# Altium project BLDC-Board-v1.0.PrjPcb (part 3 of 3)

## Sheet Power_Sheet.SchDoc
size 420 x 297 mm; SheetNumber: 2; SheetTotal: 8
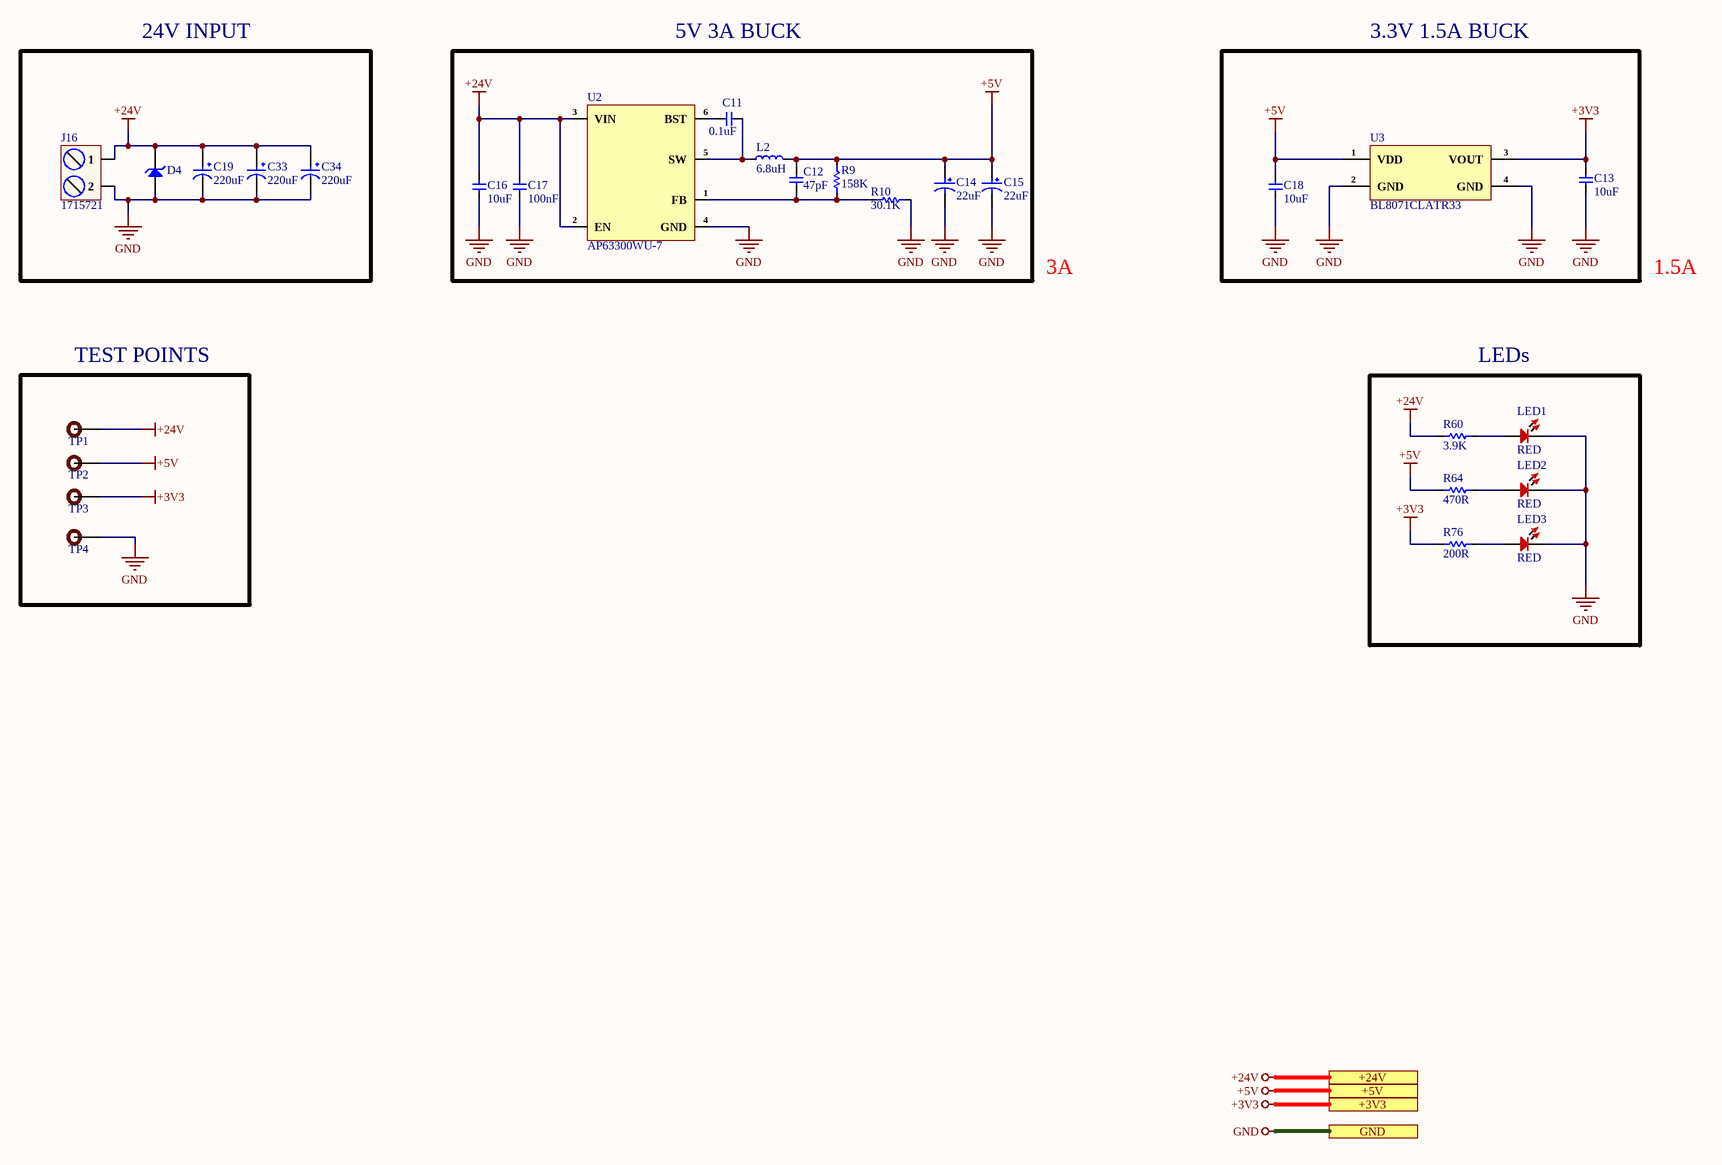
[diagram p6: Power_Sheet.SchDoc]

### Parts
C11  0.1uF  [Cap-0402]
C12  47pF  [Cap-0402]
C13  10uF  [Cap-0603]
C14  22uF  [VKMD1652D220MV]
C15  22uF  [VKMD1652D220MV]
C16  10uF  [Cap-0603]
C17  100nF  [cap-0402]
C18  10uF  [Cap-0603]
C19  220uF  [UCD-220uF-10mmDia]
C33  220uF  [UCD-220uF-10mmDia]
C34  220uF  [UCD-220uF-10mmDia]
D4  SMBJ28A-13-F  [SMB_]  (value not drawn)
J16  1715721  [1715721]
L2  6.8uH  [LVC505040-6R8M-N_]
LED1  RED  [LED-0603]
LED2  RED  [LED-0603]
LED3  RED  [LED-0603]
R9  158K  [Res-0402]
R10  30.1K  [Res-0402]
R60  3.9K  [Res-0402]
R64  470R  [Res-0402]
R76  200R  [Res-0402]
TP1  TEST POINT  [Test-point]  (value not drawn)  (no BOM)
TP2  TEST POINT  [Test-point]  (value not drawn)  (no BOM)
TP3  TEST POINT  [Test-point]  (value not drawn)  (no BOM)
TP4  TEST POINT  [Test-point]  (value not drawn)  (no BOM)
U2  AP63300WU-7  [SOT-23-6]
U3  BL8071CLATR33  [SOT- 223]

### Blocks framed on the sheet
24V INPUT: C19 C33 C34 D4 J16
5V 3A BUCK: C11 C12 C14-C17 L2 R9 R10 U2
3.3V 1.5A BUCK: C13 C18 U3
TEST POINTS: TP1-TP4

### Ports
+3V3 (see Top_Sheet[4C], CAN_Sheet[5D], Connector_Sheet1[5D], Connector_Sheet2[3D], Controller_Sheet[2D], Motor_Driver_Sheet[5D], RS485_RS232_Sheet[5D]), +5V (see Top_Sheet[4C], CAN_Sheet[5D], Connector_Sheet1[5D], Connector_Sheet2[3D]), +24V (see Top_Sheet[4C], Motor_Driver_Sheet[5D]), GND (see Top_Sheet[4C], CAN_Sheet[5D], Connector_Sheet1[5D], Connector_Sheet2[3D], Controller_Sheet[2D], Motor_Driver_Sheet[5D], RS485_RS232_Sheet[5D])

### Nets
+3V3: C13.2 R76.1 TP3.1 U3.3(VOUT) ; port +3V3
+5V: C12.2 C14.1 C15.1 C18.2 L2.2 R9.2 R64.1 TP2.1 U3.1(VDD) ; port +5V
+24V: C16.2 C17.2 C19.1 C33.1 C34.1 D4.2(K) J16.1 R60.1 TP1.1 U2.2(EN) U2.3(VIN) ; port +24V
GND: C13.1 C14.2 C15.2 C16.1 C17.1 C18.1 C19.2 C33.2 C34.2 D4.1(A) J16.2 LED1.2 LED2.2 LED3.2 R10.2 TP4.1 U2.4(GND) U3.2(GND) U3.4(GND) ; port GND
NetC11_1: C11.1 L2.1 U2.5(SW)
NetC11_2: C11.2 U2.6(BST)
NetC12_1: C12.1 R9.1 R10.1 U2.1(FB)
NetLED1_1: LED1.1 R60.2
NetLED2_1: LED2.1 R64.2
NetLED3_1: LED3.1 R76.2

### Notes on the sheet
- 3A
- 1.5A
- LEDs
- File:
- Title:
- Date:
- Page
- Num:
- Total:
- Drawn By: Huzaifa Ali

### Library data of the parts
C11 = C1005X5R1H104K050BB: CAP CER 0.1UF 50V X5R 0402; Manufacturer: TDK; Dielectric Material: Ceramic; Capacitance: 100nF; Tolerance: 10%; Item Type: Capacitor; Supplier 1: Digi-Key; Manufacturer Part Number: C1005X5R1H104K050BB; Stock 1: 1455182; Pricing 1: 1=0.12, 10=0.09, 50=0.049, 100=0.04, 500=0.02858, 1000=0.02245, 2500=0.02041, 5000=0.01878 (USD); Mount: Surface Mount; Case/Package: 0402; Case Code (Metric): 1005; Case Code (Imperial): 0402; Weight: 2.3E-05oz; Min Operating Temperature: -55°C; Max Operating Temperature: 85°C; Dielectric: X5R; Voltage Rating: 50V; Packaging: Tape and Reel; Voltage Rating (DC): 50V; Termination: SMD/SMT; Construction: Flat; Package Quantity: 1; Resistor Type: Ceramic; Voltage: 50V; Series: C; Length: 1mm; Width: 0.02inch; Height: 0.5mm; Depth: 0.5mm; Thickness: 0.022inch; Radiation Hardening: No; Lead Free: Lead Free; REACH SVHC: No SVHC; RoHS Compliant: Yes; ComponentLink1URL: https://product.tdk.com/info/en/catalog/spec/mlccspec_commercial_general_midvoltage_en.pdf?src-supplier=Digi-Key; ComponentLink1Description: https://product.tdk.com/info/en/catalog/spec/mlccspec_commercial_general_midvoltage_en.pdf?src-supplier=Digi-Key; ComponentLink2URL: http://www.tdk.co.jp/tefe02/e413_c.pdf?src-supplier=Future+Electronics; ComponentLink2Description: http://www.tdk.co.jp/tefe02/e413_c.pdf?src-supplier=Future+Electronics; ComponentLink3URL: https://www.verical.com/server-webapp/html/getDatasheet?partID=743571&src-supplier=Verical; ComponentLink3Description: https://www.verical.com/server-webapp/html/getDatasheet?partID=743571&src-supplier=Verical; ComponentLink4URL: http://www.tdk.co.jp/tefe02/e412_c.pdf?src-supplier=Avnet+Europe; ComponentLink4Description: http://www.tdk.co.jp/tefe02/e412_c.pdf?src-supplier=Avnet+Europe; Supplier Part Number 1: 445-5942-1-ND; LCSC Part Number: C2181865
C12 = GCM1555C1H470FA16D: CAP CER 47PF 50V C0G/NP0 0402; Manufacturer: Murata; Tolerance: 1%; Supplier 1: Digi-Key; Manufacturer Part Number: GCM1555C1H470FA16D; RoHS: No; Category: Ceramic Capacitors; Stock 1: 27098; Pricing 1: 1=0.11000, 10=0.07900, 50=0.04500, 100=0.03730, 500=0.02618, 1000=0.02168, 2500=0.02018, 5000=0.01846 (USD); Mount: Surface Mount; Case/Package: 0402; Case Code (Imperial): 0402; Case Code (Metric): 1005; Min Operating Temperature: -55°C; Max Operating Temperature: 125°C; Packaging: Tape and Reel; Capacitance: 47pF; Voltage Rating: 50V; Ratings: AEC-Q200; ComponentLink1URL: http://search.murata.co.jp/Ceramy/image/img/A01X/G101/ENG/GCM1555C1H470FA16-01.pdf?src-supplier=Digi-Key; ComponentLink1Description: http://search.murata.co.jp/Ceramy/image/img/A01X/G101/ENG/GCM1555C1H470FA16-01.pdf?src-supplier=Digi-Key; Supplier Part Number 1: 490-16445-1-ND; LCSC Part Number: C393684
C13 C16 C18 = C1608X5R1E106M080AC: CAP CER 10UF 25V X5R 0603; Manufacturer: TDK; Dielectric Material: Ceramic; Tolerance: 20%; Item Type: Capacitor; Supplier 1: Digi-Key; Manufacturer Part Number: C1608X5R1E106M080AC; Stock 1: 61681; Pricing 1: 1=0.96, 10=0.704, 100=0.483, 500=0.38238, 1000=0.322 (USD); Mount: Surface Mount; Case/Package: 0603; Weight: 7.1E-05oz; Case Code (Imperial): 0603; Case Code (Metric): 1608; Min Operating Temperature: -55°C; Max Operating Temperature: 85°C; Capacitance: 10uF; Packaging: Tape and Reel; Voltage Rating: 25V; Voltage Rating (DC): 25V; Termination: SMD/SMT; Package Quantity: 1; Dielectric: X5R; Composition: Ceramic; Length: 1.6mm; Height: 0.8mm; Width: 0.8mm; Thickness: 0.039inch; Depth: 0.8mm; Lead Free: Lead Free; REACH SVHC: No SVHC; Supplier Part Number 1: 445-9015-1-ND; LCSC Part Number: C2168289
C14 C15 = VKMD1652D220MV: 22uF 200V 320mA@100kHz ±20% SMD,D8xL16.5mm Aluminum Electrolytic Capacitors - SMD ROHS; Manufacturer: Ymin; Manufacturer Part Number: VKMD1652D220MV; Package: SMD,D8xL16.5mm; LCSC Part Number: C487500; Item Type: Electrolytic Capacitor; ComponentLink1Description: LCSC; ComponentLink1URL: https://www.lcsc.com/product-detail/Aluminum-Electrolytic-Capacitors-SMD_Ymin-VKMD1652D220MV_C487500.html
C17 = C1005X7R1H104KT000F: CAP CER 0.1UF 50V X7R 0402; Manufacturer: TDK; Tolerance: 10%; Voltage: 25V; Item Type: Capacitor; Supplier 1: Avnet; Manufacturer Part Number: C1005X7R1H104KT000F; RoHS: No; Category: Ceramic Capacitors; Dielectric: X7R; Supplier Part Number 1: C1005X7R1H104KT000F; LCSC Part Number: C361198; ComponentLink1Description: LCSC; ComponentLink1URL: https://www.lcsc.com/product-detail/Multilayer-Ceramic-Capacitors-MLCC-SMD-SMT_TDK-C1005X7R1H104KT000F_C361198.html
C19 C33 C34 = UCD1H221MNL1GS: CAP ALUM 220UF 20% 50V SMD; Manufacturer: Nichicon; Ripple Current: 700mA; Impedance: 160mR; Leakage Current: 3uA; Life (Hours): 5000Hour; Dissipation Factor: 0.1%; Item Type: Capacitor; Supplier 1: Digi-Key; Manufacturer Part Number: UCD1H221MNL1GS; RoHS: Yes; Category: Aluminum Electrolytic Capacitors; Pricing 1: 1=0.85000, 10=0.60200, 50=0.45480, 100=0.39620 (USD); Mount: Surface Mount,PCB; Case/Package: Radial; Min Operating Temperature: -55°C; Max Operating Temperature: 105°C; Capacitance: 220uF; Tolerance: 20%; Voltage Rating: 50V; Packaging: Tape and Reel; Package Quantity: 1; Voltage Rating (DC): 50V; Termination: SMD/SMT; Voltage: 50V; Features: General Purpose; Series: CD; Construction: Cylindrical; Diameter: 10mm; Length: 10mm; Height: 10mm; Height - Seated (Max): 0.394inch; Radiation Hardening: No; Lead Free: Lead Free; RoHS Compliant: Yes; ComponentLink1URL: https://datasheet.ciiva.com/11776/0900766b80ebdadd-11776792.pdf?src-supplier=RSComponents; ComponentLink1Description: https://datasheet.ciiva.com/11776/0900766b80ebdadd-11776792.pdf?src-supplier=RSComponents; ComponentLink2URL: https://datasheet.ciiva.com/5362/e-cd-22158-5362489.pdf?src-supplier=Mouser; ComponentLink2Description: https://datasheet.ciiva.com/5362/e-cd-22158-5362489.pdf?src-supplier=Mouser; ComponentLink3URL: https://datasheet.ciiva.com/11684/e-cd-11684678.pdf?src-supplier=Avnet; ComponentLink3Description: https://datasheet.ciiva.com/11684/e-cd-11684678.pdf?src-supplier=Avnet; ComponentLink4URL: https://datasheet.ciiva.com/15037/e-cd-15037119.pdf?src-supplier=Digi-Key; ComponentLink4Description: https://datasheet.ciiva.com/15037/e-cd-15037119.pdf?src-supplier=Digi-Key; ComponentLink5URL: https://datasheet.ciiva.com/16393/e-cd-16393493.pdf?src-supplier=Future+Electronics; ComponentLink5Description: https://datasheet.ciiva.com/16393/e-cd-16393493.pdf?src-supplier=Future+Electronics; ComponentLink6URL: https://datasheet.ciiva.com/17354/e-cd-17354606.pdf?src-supplier=Avnet+Europe; ComponentLink6Description: https://datasheet.ciiva.com/17354/e-cd-17354606.pdf?src-supplier=Avnet+Europe; Supplier Part Number 1: 493-6390-1-ND; LCSC Part Number: C116211
D4 = SMBJ28A-13-F: TVS DIODE 28VWM 45.4VC SMB; Manufacturer: Diodes; Test Current: 1mA; Number of Elements: 1; Power Dissipation: 600W; Forward Voltage: 5V; Direction: Unidirectional; Reverse Breakdown Voltage: 31.1V; Max Surge Current: 13.2A; Reverse Standoff Voltage: 28V; Clamping Voltage: 45.4V; Power Line Protection: No; Breakdown Voltage: 35.8V; Max Reverse Leakage Current: 5uA; Value: 330pF; Diode Type: ZENER; Supplier: Future Electronics; Supplier Part Number: 8797342; Manufacturer Part Number: SMBJ28A-13-F; RoHS: Yes; Category: TVS Diodes; Stock: 39000; Pricing: 3000=0.0734, 9000=0.0706, 15000=0.0693, 30000=0.0676, 60000=0.065 (USD); Mounting Technology: Surface Mount; Case/Package: SMB; Pins: 2; Min Operating Temperature: -55°C; Max Operating Temperature: 150°C; Packaging: Tape and Reel; Package Quantity: 3000; Max Power Dissipation: 600W; Series: SMBJ; Number of Unidirectional Channels: 1; Min Breakdown Voltage: 31.1V; Peak Pulse Power: 600W; Polarity: Unidirectional; Termination: SMD/SMT; Peak Pulse Current: 13.2A; Max Breakdown Voltage: 35.8V; Leakage Current: 5uA; Working Voltage: 28V; Voltage Rating (DC): 28V; Max Output current: 13.2A; Clamping Voltage-Max: 45.4V; Length: 4.57mm; Width: 3.9mm; Height: 2.62mm; Radiation Hardening: No; RoHS Compliant: Yes; Lead Free: Lead Free; ComponentLink1URL: https://datasheet.ciiva.com/16387/ds19002-16387564.pdf?src-supplier=Future+Electronics; ComponentLink1Description: https://datasheet.ciiva.com/16387/ds19002-16387564.pdf?src-supplier=Future+Electronics; ComponentLink2URL: https://datasheet.ciiva.com/26912/getdatasheetpartid-234000-26912533.pdf?src-supplier=Verical; ComponentLink2Description: https://datasheet.ciiva.com/26912/getdatasheetpartid-234000-26912533.pdf?src-supplier=Verical; Item Type: Diode
J16 = 1715721: TERM BLK 2P SIDE ENT 5.08MM PCB; Manufacturer: Phoenix Contact; Item Type: Terminal Blocks; Supplier: Digikey; Supplier Part Number: 277-1263-ND; Manufacturer Part Number: 1715721; RoHS: Yes; Stock: 13160; Pricing: 1=0.94 (USD); ComponentLink1URL: https://datasheet.ciiva.com/1120/1697161-1120393.pdf?src-supplier=Farnell; ComponentLink1Description: https://datasheet.ciiva.com/1120/1697161-1120393.pdf?src-supplier=Farnell; ComponentLink2URL: https://datasheet.ciiva.com/832/1715721-832095.pdf?src-supplier=Digikey; ComponentLink2Description: https://datasheet.ciiva.com/832/1715721-832095.pdf?src-supplier=Digikey; ComponentLink3URL: https://datasheet.ciiva.com/15169/getdatasheetpartid-212174-15169929.pdf?src-supplier=Verical; ComponentLink3Description: https://datasheet.ciiva.com/15169/getdatasheetpartid-212174-15169929.pdf?src-supplier=Verical; ComponentLink4URL: https://datasheet.ciiva.com/16046/1715721-16046034.pdf?src-supplier=Onlinecomponents.com; ComponentLink4Description: https://datasheet.ciiva.com/16046/1715721-16046034.pdf?src-supplier=Onlinecomponents.com
L2 = LVC505040-6R8M-N: 2.7A 6.8uH ±20% 50mΩ SMD Power Inductors ROHS; Manufacturer: Chlisin Elec; ComponentLink1Description: LCSC; ComponentLink1URL: https://www.lcsc.com/product-detail/Power-Inductors_Chilisin-Elec-LVC505040-6R8M-N_C285870.html; Manufacturer Part Number: LVC505040-6R8M-N; Value: 6.8uH; Footprint: Custom; LCSC Part Number: C285870; Item Type: Inductor
LED1-LED3 = NCD0603R3: RED LED 0603 Light Emitting Diodes; Manufacturer: Foshan NationStar Optoelectronics; Manufacturer Part Number: NCD0603R3; Package: 0603; Item Type: LED; LCSC Part Number: C3151730; ComponentLink1Description: LCSC; ComponentLink1URL: https://www.lcsc.com/product-detail/Light-Emitting-Diodes-LED_Foshan-NationStar-Optoelectronics-NCD0603R3_C3151730.html
R9 = RT0402BRE07158KL: RES 158K OHM 0.1% 1/16W 0402; Manufacturer: Yageo; Item Type: Resistor; Supplier: Digikey; Supplier Part Number: RT0402BRE07158KL-ND; Manufacturer Part Number: RT0402BRE07158KL; RoHS: Yes; Pricing: 10000=0.08507 (USD); LCSC Part Number: C853045
R10 = RT0402BRD0730K1L: RES SMD 30.1KOHM 0.1% 1/16W 0402; Manufacturer: Yageo; Item Type: Resistor; Supplier: Rs; Supplier Part Number: 1991324P; Manufacturer Part Number: RT0402BRD0730K1L; RoHS: Yes; Category: Chip SMD Resistors; Stock: 7420; Pricing: 100=0.138, 250=0.115, 500=0.092, 1000=0.076 (GBP); ComponentLink1URL: https://datasheet.ciiva.com/12722/pyu-rt-1-to-0-05-rohs-l-4-12722119.pdf?src-supplier=Mouser; ComponentLink1Description: https://datasheet.ciiva.com/12722/pyu-rt-1-to-0-05-rohs-l-4-12722119.pdf?src-supplier=Mouser; ComponentLink2URL: https://datasheet.ciiva.com/2582/pyu-rt-1-to-0-05-rohs-l-5-2582303.pdf?src-supplier=Digi-Key; ComponentLink2Description: https://datasheet.ciiva.com/2582/pyu-rt-1-to-0-05-rohs-l-5-2582303.pdf?src-supplier=Digi-Key; LCSC Part Number: C852714
R60 = RC0402FR-073K9L: RES 3.9K OHM 1% 1/16W 0402; Manufacturer: Yageo; Temperature Coefficient: 100ppm/°C; Power Rating: 62.5mW; Value: 3.9kR; Voltage Rating: 50V; Max Power Dissipation: 63mW; Item Type: Resistor; Supplier: Future Electronics; Supplier Part Number: 9808155; Manufacturer Part Number: RC0402FR-073K9L; RoHS: Yes; Category: Chip SMD Resistors; Stock: 6910000; Pricing: 10000=0.0011, 100000=0.0011, 300000=0.001, 750000=0.001, 2000000=0.0009 (USD); Case/Package: 0402; Case Code (Imperial): 0402; Case Code (Metric): 1005; Min Operating Temperature: -55°C; Max Operating Temperature: 155°C; Tolerance: 1%; Packaging: Tape and Reel; Resistor Type: Thick Film; Series: RC; Termination: SMD/SMT; Number of Terminations: 2; Features: Moisture Resistant; Resistance Tolerance: 1%; Construction: Rectangular; Voltage Rating (AC): 50V; Length: 1mm; Depth: 0.5mm; Lead Free: Lead Free; RoHS Compliant: Yes; Reach SVHC Compliant: Unknown; Military Standard: Not; ComponentLink1URL: https://datasheet.ciiva.com/12666/pyu-rc0402-51-rohs-l-6-r-12666997.pdf?src-supplier=Mouser; ComponentLink1Description: https://datasheet.ciiva.com/12666/pyu-rc0402-51-rohs-l-6-r-12666997.pdf?src-supplier=Mouser; ComponentLink2URL: https://datasheet.ciiva.com/7849/1018594-7849989.pdf?src-supplier=Element14; ComponentLink2Description: https://datasheet.ciiva.com/7849/1018594-7849989.pdf?src-supplier=Element14; ComponentLink3URL: https://datasheet.ciiva.com/7849/1018594-7849990.pdf?src-supplier=Element14; ComponentLink3Description: https://datasheet.ciiva.com/7849/1018594-7849990.pdf?src-supplier=Element14; ComponentLink4URL: https://datasheet.ciiva.com/15189/getdatasheetpartid-469246-15189453.pdf?src-supplier=Verical; ComponentLink4Description: https://datasheet.ciiva.com/15189/getdatasheetpartid-469246-15189453.pdf?src-supplier=Verical; LCSC Part Number: C131467
R64 = RC0402FR-07470RL: RES 470 OHM 1% 1/16W 0402; Manufacturer: Yageo; Item Type: Resistor; Voltage Rating: 50V; Power Rating: 62.5mW; Temperature Coefficient: 100ppm/°C; Max Power Dissipation: 63mW; Supplier: Avnet; Supplier Part Number: RC0402FR-07470RL; Manufacturer Part Number: RC0402FR-07470RL; RoHS: Yes; Stock: 10000; Pricing: 10000=0.00085 (USD); Case/Package: 0402; Case Code (Metric): 1005; Case Code (Imperial): 0402; Min Operating Temperature: -55°C; Max Operating Temperature: 155°C; Packaging: Tape and Reel; Value: 470R; Tolerance: 1%; Number of Terminations: 2; Working Voltage: 50V; Package Quantity: 1; Resistor Type: Thick Film; Termination: SMD/SMT; Features: Moisture Resistant; Series: RC; Resistance Tolerance: 1%; Construction: Rectangular; Voltage Rating (AC): 50V; Length: 1mm; Width: 0.02inch; Height: 0.016inch; Depth: 0.5mm; Lead Free: Lead Free; Reach SVHC Compliant: No; RoHS Compliant: Yes; Military Standard: Not; ComponentLink1URL: https://datasheet.ciiva.com/46412/1018594-46412838.pdf?src-supplier=Element14; ComponentLink1Description: https://datasheet.ciiva.com/46412/1018594-46412838.pdf?src-supplier=Element14; ComponentLink2URL: https://datasheet.ciiva.com/2453/pyu-r-int-thick-7-2453377.pdf?src-supplier=Digikey; ComponentLink2Description: https://datasheet.ciiva.com/2453/pyu-r-int-thick-7-2453377.pdf?src-supplier=Digikey; ComponentLink3URL: https://datasheet.ciiva.com/2453/pyu-r-int-thick-7-2453378.pdf?src-supplier=Digikey; ComponentLink3Description: https://datasheet.ciiva.com/2453/pyu-r-int-thick-7-2453378.pdf?src-supplier=Digikey; ComponentLink4URL: https://datasheet.ciiva.com/2453/pyu-r-int-thick-7-2453376.pdf?src-supplier=Digikey; ComponentLink4Description: https://datasheet.ciiva.com/2453/pyu-r-int-thick-7-2453376.pdf?src-supplier=Digikey; ComponentLink5URL: https://datasheet.ciiva.com/7850/1018594-7850015.pdf?src-supplier=Element14; ComponentLink5Description: https://datasheet.ciiva.com/7850/1018594-7850015.pdf?src-supplier=Element14; ComponentLink6URL: https://datasheet.ciiva.com/7850/1018594-7850014.pdf?src-supplier=Element14; ComponentLink6Description: https://datasheet.ciiva.com/7850/1018594-7850014.pdf?src-supplier=Element14; ComponentLink7URL: https://datasheet.ciiva.com/15189/getdatasheetpartid-330246-15189463.pdf?src-supplier=Verical; ComponentLink7Description: https://datasheet.ciiva.com/15189/getdatasheetpartid-330246-15189463.pdf?src-supplier=Verical; LCSC Part Number: C114877
R76 = RC0402FR-07200RL: RES 200 OHM 1% 1/16W 0402; Manufacturer: Yageo; Temperature Coefficient: 100ppm/°C; Power Rating: 63mW; Voltage Rating (DC): 50V; Supplier 1: Digi-Key; Manufacturer Part Number: RC0402FR-07200RL; RoHS: Yes; Category: Chip SMD Resistors; Stock 1: 19778; Pricing 1: 1=0.10000, 10=0.01600, 100=0.00660, 1000=0.00299, 2500=0.00259, 5000=0.00214 (USD); Case/Package: 0402; Case Code (Metric): 1005; Case Code (Imperial): 0402; Size Code: 0402; Min Operating Temperature: -55°C; Max Operating Temperature: 155°C; Tolerance: 1%; Resistance: 200R; Resistor Type: Thick Film; Packaging: Tape and Reel; Voltage Rating: 50V; Package Quantity: 1; Number of Terminations: 2; Termination: SMD/SMT; Max Power Dissipation: 63mW; Features: Moisture Resistant; Series: RC; Construction: Rectangular; Resistance Tolerance: 1%; Length: 1mm; Width: 0.02inch; Height: 0.016inch; Depth: 0.5mm; REACH SVHC: No SVHC; Lead Free: Lead Free; RoHS Compliant: Yes; Military Standard: Not; ComponentLink1URL: https://datasheet.ciiva.com/2553/pyu-r-int-thick-7-2553232.pdf?src-supplier=Digi-Key; ComponentLink1Description: https://datasheet.ciiva.com/2553/pyu-r-int-thick-7-2553232.pdf?src-supplier=Digi-Key; ComponentLink2URL: https://datasheet.ciiva.com/7983/1018594-7983509.pdf?src-supplier=Element14; ComponentLink2Description: https://datasheet.ciiva.com/7983/1018594-7983509.pdf?src-supplier=Element14; ComponentLink3URL: https://datasheet.ciiva.com/16804/pyu-rc0402-51-rohs-l-6-r-16804406.pdf?src-supplier=Future+Electronics; ComponentLink3Description: https://datasheet.ciiva.com/16804/pyu-rc0402-51-rohs-l-6-r-16804406.pdf?src-supplier=Future+Electronics; ComponentLink4URL: https://datasheet.ciiva.com/15189/getdatasheetpartid-331152-15189383.pdf?src-supplier=Verical; ComponentLink4Description: https://datasheet.ciiva.com/15189/getdatasheetpartid-331152-15189383.pdf?src-supplier=Verical; ComponentLink5URL: https://datasheet.ciiva.com/7849/1018594-7849898.pdf?src-supplier=Element14; ComponentLink5Description: https://datasheet.ciiva.com/7849/1018594-7849898.pdf?src-supplier=Element14; ComponentLink6URL: https://datasheet.ciiva.com/5562/pyu-rc0402-51-rohs-l-6-r-8721-5562539.pdf?src-supplier=Mouser; ComponentLink6Description: https://datasheet.ciiva.com/5562/pyu-rc0402-51-rohs-l-6-r-8721-5562539.pdf?src-supplier=Mouser; ComponentLink7URL: https://datasheet.ciiva.com/7849/1018594-7849899.pdf?src-supplier=Element14; ComponentLink7Description: https://datasheet.ciiva.com/7849/1018594-7849899.pdf?src-supplier=Element14; ComponentLink8URL: https://datasheet.ciiva.com/2553/pyu-r-int-thick-7-2553230.pdf?src-supplier=Digi-Key; ComponentLink8Description: https://datasheet.ciiva.com/2553/pyu-r-int-thick-7-2553230.pdf?src-supplier=Digi-Key; ComponentLink9URL: https://datasheet.ciiva.com/2553/pyu-r-int-thick-7-2553231.pdf?src-supplier=Digi-Key; ComponentLink9Description: https://datasheet.ciiva.com/2553/pyu-r-int-thick-7-2553231.pdf?src-supplier=Digi-Key; Supplier Part Number 1: 311-200LRCT-ND; LCSC Part Number: C114764
TP1-TP4 = TEST POINT: Test Point ON; Item Type: TEST POINT
U2 = AP63300WU-7: IC REG BUCK ADJ 3A TSOT26; Manufacturer: Diodes; Output Type: Adjustable; Output Configuration: Positive; Number of Outputs: 1; Min Input Voltage: 3.8V; Max Supply Voltage: 32V; Min Output Voltage: 800mV; Max Output Voltage: 31V; Switching Frequency: 500kHz; Synchronous Rectifier: Yes; Supplier: Digikey; Supplier Part Number: 31-AP63300WU-7CT-ND; Manufacturer Part Number: AP63300WU-7; RoHS: No; Category: Voltage Regulators - Switching; Stock: 11398; Pricing: 1=0.92, 10=0.818, 25=0.7764, 100=0.6379, 250=0.59628, 500=0.52696, 1000=0.41602 (USD); Mounting Technology: Surface Mount; Case/Package: SOT-23-6; Min Operating Temperature: -40°C; Max Operating Temperature: 85°C; Series: -; Output Current: 3A; RoHS Compliant: Yes; ComponentLink1URL: https://www.diodes.com/assets/Datasheets/AP63300-AP63301.pdf?src-supplier=Digikey; ComponentLink1Description: https://www.diodes.com/assets/Datasheets/AP63300-AP63301.pdf?src-supplier=Digikey; ComponentLink2URL: https://datasheet.octopart.com/AP63300WU-7-Diodes-Inc.-datasheet-149521342.pdf?src-supplier=Future+Electronics; ComponentLink2Description: https://datasheet.octopart.com/AP63300WU-7-Diodes-Inc.-datasheet-149521342.pdf?src-supplier=Future+Electronics; LCSC Part Number: C2158012; Item Type: IC
U3 = BL8071CLATR33: 70dB@(100Hz) 1.5A Fixed 3.3V~3.3V Positive 6V SOT-223 Linear Voltage Regulators (LDO) ROHS; Manufacturer: BL(Shanghai Belling); Item Type: IC; Manufacturer Part Number: BL8071CLATR33; Package: SOT-223; LCSC Part Number: C401677; ComponentLink1Description: LCSC; ComponentLink1URL: https://www.lcsc.com/product-detail/Linear-Voltage-Regulators-LDO_BL-Shanghai-Belling-BL8071CLATR33_C401677.html

## Sheet RS485_RS232_Sheet.SchDoc
size 420 x 297 mm; SheetNumber: 5; SheetTotal: 8
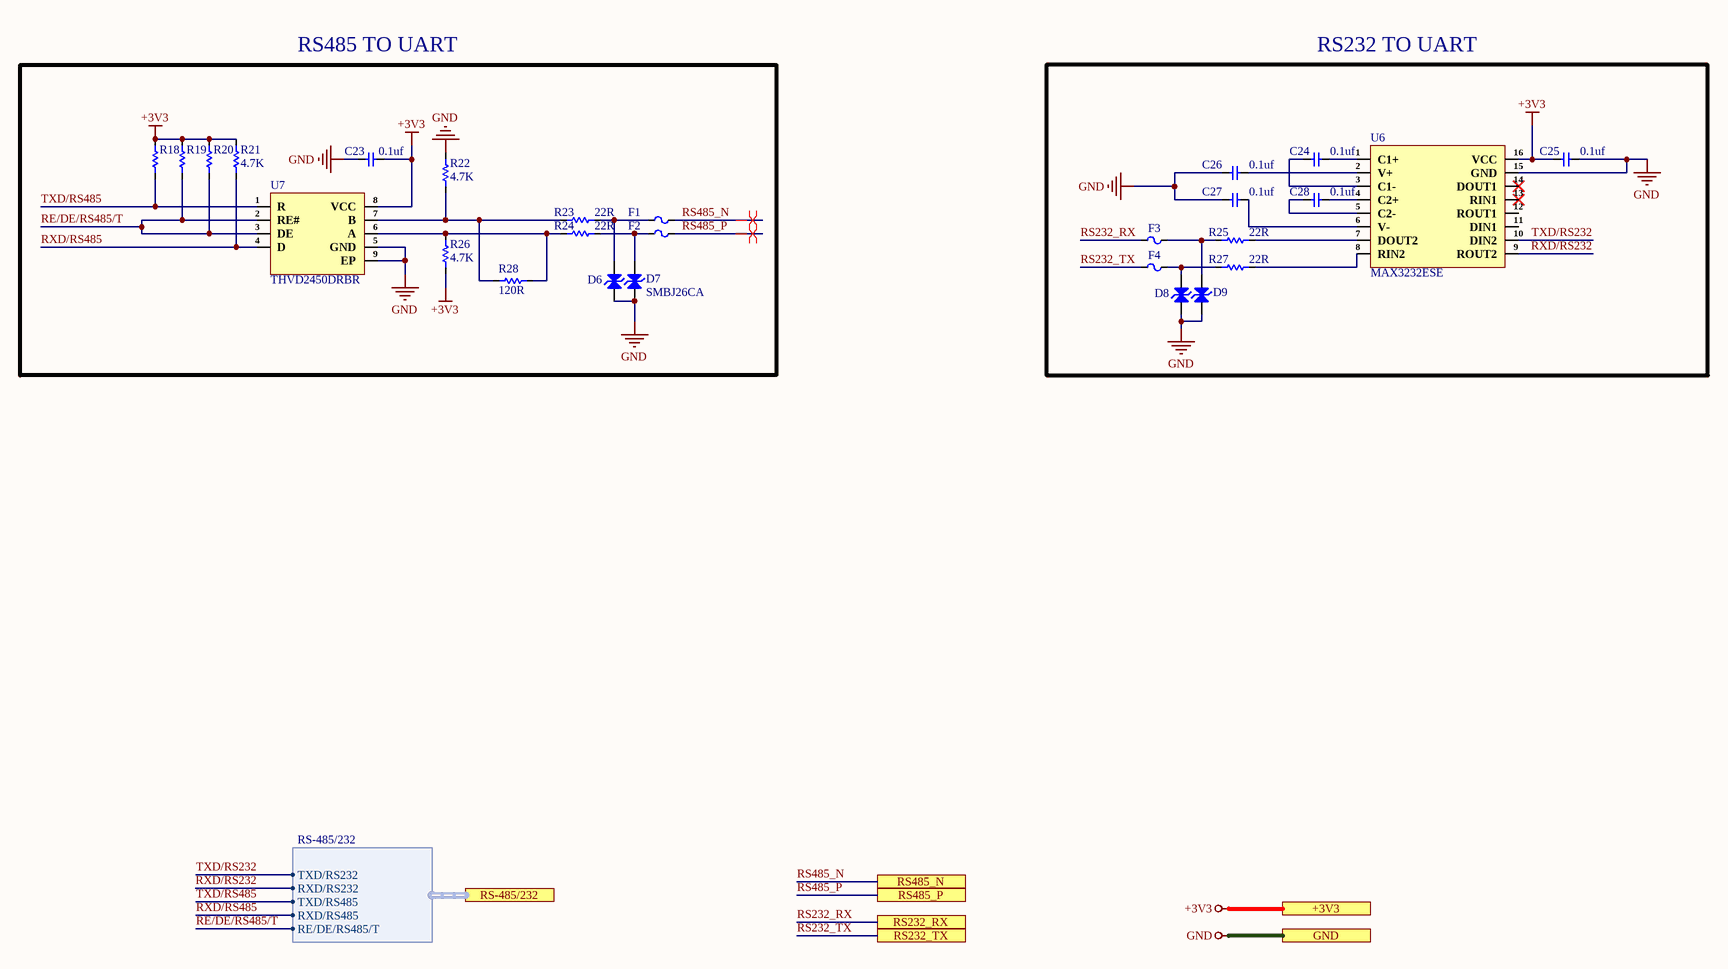
[diagram p7: RS485_RS232_Sheet.SchDoc]

### Parts
C23  0.1uf  [Cap-0402]
C24  0.1uf  [Cap-0402]
C25  0.1uf  [Cap-0402]
C26  0.1uf  [Cap-0402]
C27  0.1uf  [Cap-0402]
C28  0.1uf  [Cap-0402]
D6  SMBJ26CA  [SMB Bi Directional]  (value not drawn)
D7  SMBJ26CA  [SMB Bi Directional]
D8  SMBJ26CA  [SMB Bi Directional]  (value not drawn)
D9  SMBJ26CA  [SMB Bi Directional]  (value not drawn)
F1  SMD0805P020TF  [Fuse-0805]  (value not drawn)
F2  SMD0805P020TF  [Fuse-0805]  (value not drawn)
F3  SMD0805P020TF  [Fuse-0805]  (value not drawn)
F4  SMD0805P020TF  [Fuse-0805]  (value not drawn)
R18  4.7K  [Res-0402]  (value not drawn)
R19  4.7K  [Res-0402]  (value not drawn)
R20  4.7K  [Res-0402]  (value not drawn)
R21  4.7K  [Res-0402]
R22  4.7K  [Res-0402]
R23  22R  [Res-0201]
R24  22R  [Res-0201]
R25  22R  [Res-0201]
R26  4.7K  [Res-0402]
R27  22R  [Res-0201]
R28  120R  [Res-0603]
U6  MAX3232ESE  [SOP-16]
U7  THVD2450DRBR  [SON-8-EP(3x3)]

### Ports
+3V3 (see Top_Sheet[4B], CAN_Sheet[5D], Connector_Sheet1[5D], Connector_Sheet2[3D], Controller_Sheet[2D], Motor_Driver_Sheet[5D], Power_Sheet[5D]), GND (see Top_Sheet[4B], CAN_Sheet[5D], Connector_Sheet1[5D], Connector_Sheet2[3D], Controller_Sheet[2D], Motor_Driver_Sheet[5D], Power_Sheet[5D]), RS232_RX (see Top_Sheet[4B], Connector_Sheet1[4D]), RS232_TX (see Top_Sheet[4B], Connector_Sheet1[4D]), RS485_N (see Top_Sheet[4B], Connector_Sheet1[3D]), RS485_P (see Top_Sheet[4B], Connector_Sheet1[3D]), RS-485/232 (harness RS-485/232, see Top_Sheet[4B], Controller_Sheet[4D])

### Harnesses
RS-485/232: TXD/RS232, RXD/RS232, TXD/RS485, RXD/RS485, RE/DE/RS485/T

### Nets
+3V3: C23.2 C25.2 R18.2 R19.2 R20.2 R21.2 R26.1 U6.16(VCC) U7.8(VCC) ; port +3V3
GND: C23.1 C25.1 C26.1 C27.1 D6.1(A) D7.1(A) D8.1(A) D9.1(A) R22.2 U6.15(GND) U7.5(GND) U7.9(EP) ; port GND
RE/DE/RS485/T: R19.1 R20.1 U7.2(RE#) U7.3(DE) ; port RS-485/232.RE/DE/RS485/T
RS232_RX: F3.1 ; port RS232_RX
RS232_TX: F4.1 ; port RS232_TX
RS485_N: F1.2 ; port RS485_N
RS485_P: F2.2 ; port RS485_P
RXD/RS232: U6.9(ROUT2) ; port RS-485/232.RXD/RS232
RXD/RS485: R21.1 U7.4(D) ; port RS-485/232.RXD/RS485
TXD/RS232: U6.10(DIN2) ; port RS-485/232.TXD/RS232
TXD/RS485: R18.1 U7.1(R) ; port RS-485/232.TXD/RS485
NetC24_1: C24.1 U6.1(C1+)
NetC24_2: C24.2 U6.3(C1-)
NetC26_2: C26.2 U6.2(V+)
NetC27_2: C27.2 U6.6(V-)
NetC28_1: C28.1 U6.4(C2+)
NetC28_2: C28.2 U6.5(C2-)
NetD6_2: D6.2(K) F1.1 R23.2
NetD7_2: D7.2(K) F2.1 R24.2
NetD8_2: D8.2(K) F4.2 R27.1
NetD9_2: D9.2(K) F3.2 R25.1
NetR22_1: R22.1 R23.1 R28.1 U7.7(B)
NetR24_1: R24.1 R26.2 R28.2 U7.6(A)
NetR25_2: R25.2 U6.7(DOUT2)
NetR27_2: R27.2 U6.8(RIN2)

Not connected (* = marked no-connect by the designer): U6 11(DIN1) 12(ROUT1) 13(RIN1)* 14(DOUT1)*

### Layout directives
differential pair; net class RS485; differential pair class RS485_LINES; rule Impedance Constraint [Min = 115.0    Max = 125.0    ]; rule Matched Net Lengths [Tolerance = 0.508mm]: RS485_N, RS485_P

### Notes on the sheet
- RS485 TO UART
- RS232 TO UART
- File:
- Title:
- Date:
- Page
- Num:
- Total:
- Drawn By: Huzaifa Ali

### Library data of the parts
C23-C28 = GRM155R62A104KE14D: CAP CER 0.1UF 100V X5R 0402; Manufacturer: Murata; Capacitance: 100nF; Tolerance: 10%; Item Type: Capacitor; Supplier 1: Arrow Electronics; Manufacturer Part Number: GRM155R62A104KE14D; RoHS: Yes; Category: Ceramic Capacitors; Stock 1: 870000; Pricing 1: 10000=0.00500, 20000=0.00410, 30000=0.00390, 50000=0.00370, 100000=0.00300 (USD); Mount: Surface Mount; Case/Package: 0402; Case Code (Metric): 1005; Case Code (Imperial): 0402; Weight: 0.000212oz; Min Operating Temperature: -55°C; Max Operating Temperature: 85°C; Packaging: Tape and Reel; Voltage Rating: 100V; Dielectric: X5R; Termination: SMD/SMT; Voltage Rating (DC): 100V; Package Quantity: 10000; Series: GRM; Length: 0.039inch; Width: 0.02inch; Height: 0.5mm; Thickness: 0.022inch; Reach SVHC Compliant: Yes; Lead Free: Lead Free; RoHS Compliant: Yes; ComponentLink1URL: http://www.farnell.com/datasheets/2079151.pdf?src-supplier=Farnell; ComponentLink1Description: http://www.farnell.com/datasheets/2079151.pdf?src-supplier=Farnell; ComponentLink2URL: http://www.mouser.com/ds/2/281/c02e-2905.pdf?src-supplier=Mouser; ComponentLink2Description: http://www.mouser.com/ds/2/281/c02e-2905.pdf?src-supplier=Mouser; ComponentLink3URL: http://www.farnell.com/datasheets/2079151.pdf?src-supplier=Element14; ComponentLink3Description: http://www.farnell.com/datasheets/2079151.pdf?src-supplier=Element14; ComponentLink4URL: http://search.murata.co.jp/Ceramy/image/img/A01X/G101/ENG/GRM155R62A104KE14-01.pdf?src-supplier=Digi-Key; ComponentLink4Description: http://search.murata.co.jp/Ceramy/image/img/A01X/G101/ENG/GRM155R62A104KE14-01.pdf?src-supplier=Digi-Key; ComponentLink5URL: http://www.farnell.com/datasheets/2079151.pdf?src-supplier=Newark; ComponentLink5Description: http://www.farnell.com/datasheets/2079151.pdf?src-supplier=Newark; Supplier Part Number 1: GRM155R62A104KE14D; LCSC Part Number: C162178
D6-D9 = SMBJ26CA: SMB(DO-214AA) TVS ROHS; Manufacturer: MSKSEMI; Item Type: Diode; Manufacturer Part Number: SMBJ26CA; Package: SMB(DO-214AA); LCSC Part Number: C5331111; ComponentLink1Description: LCSC; ComponentLink1URL: https://www.lcsc.com/product-detail/TVS_MSKSEMI-SMBJ26CA_C5331111.html
F1-F4 = SMD0805P020TF: 9V 200mA 100A 500mA 0805 Resettable Fuses ROHS; Manufacturer: RUILON; Item Type: Fuse; Manufacturer Part Number: SMD0805P020TF; Package: 0805; LCSC Part Number: C20976; ComponentLink1Description: LCSC; ComponentLink1URL: https://www.lcsc.com/product-detail/Resettable-Fuses_RUILON-Shenzhen-Ruilongyuan-Elec-SMD0805P020TF_C20976.html
R18-R22 R26 = RC0402FR-074K7L: RES 4.7K OHM 1% 1/16W 0402; Manufacturer: Yageo; Voltage Rating (DC): 50V; Power Rating: 62.5mW; Resistance: 4.7kR; Temperature Coefficient: 100ppm/°C; Max Power Dissipation: 63mW; Item Type: Resistor; Supplier 1: Avnet; Manufacturer Part Number: RC0402FR-074K7L; RoHS: Yes; Category: Chip SMD Resistors; Stock 1: 2420000; Pricing 1: 10000=0.00085 (USD); Case/Package: 0402; Number of Pins: 2; Case Code (Imperial): 0402; Case Code (Metric): 1005; Size Code: 0402; Min Operating Temperature: -55°C; Max Operating Temperature: 155°C; Tolerance: 1%; Voltage Rating: 50V; Packaging: Tape and Reel; Resistor Type: Thick Film; Termination: SMD/SMT; Features: Moisture Resistant; Series: RC; Number of Terminations: 2; Resistance Tolerance: 1%; Construction: Rectangular; Length: 1mm; Width: 0.5mm; Height: 0.32mm; Depth: 0.5mm; Height - Seated (Max): 0.016inch; RoHS Compliant: Yes; Reach SVHC Compliant: Yes; Military Standard: Not; Lead Free: Lead Free; ComponentLink1URL: https://datasheet.ciiva.com/22661/1686128-22661342.pdf?src-supplier=Element14; ComponentLink1Description: https://datasheet.ciiva.com/22661/1686128-22661342.pdf?src-supplier=Element14; ComponentLink2URL: https://datasheet.ciiva.com/7850/1018594-7850022.pdf?src-supplier=Element14; ComponentLink2Description: https://datasheet.ciiva.com/7850/1018594-7850022.pdf?src-supplier=Element14; ComponentLink3URL: https://datasheet.ciiva.com/7850/1018594-7850023.pdf?src-supplier=Element14; ComponentLink3Description: https://datasheet.ciiva.com/7850/1018594-7850023.pdf?src-supplier=Element14; ComponentLink4URL: https://datasheet.ciiva.com/15215/getdatasheetpartid-328119-15215035.pdf?src-supplier=Verical; ComponentLink4Description: https://datasheet.ciiva.com/15215/getdatasheetpartid-328119-15215035.pdf?src-supplier=Verical; Supplier Part Number 1: RC0402FR-074K7L; LCSC Part Number: C105871
R23-R25 R27 = RC0201FR-0722RL: RES 22 OHM 1% 1/20W 0201; Manufacturer: Yageo; Item Type: Resistor; Supplier: Future Electronics; Supplier Part Number: 5973409; Manufacturer Part Number: RC0201FR-0722RL; RoHS: Yes; Category: Chip SMD Resistors; Stock: 17980000; Pricing: 10000=0.0014, 50000=0.0013, 250000=0.0013, 750000=0.0012, 2000000=0.0011 (USD); ComponentLink1URL: https://datasheet.ciiva.com/7672/1563626-7672215.pdf?src-supplier=Element14; ComponentLink1Description: https://datasheet.ciiva.com/7672/1563626-7672215.pdf?src-supplier=Element14; LCSC Part Number: C155743
R28 = RC0603JR-07120RL: RES 120 OHM 5% 1/10W 0603; Manufacturer: Yageo; Voltage Rating (AC): 50V; Item Type: Resistor; Supplier: Future Electronics; Supplier Part Number: 4045720; Manufacturer Part Number: RC0603JR-07120RL; RoHS: Yes; Category: Chip SMD Resistors; Stock: 570000; Pricing: 5000=0.0015, 75000=0.0015, 250000=0.0014, 750000=0.0013, 2500000=0.0012 (USD); ComponentLink1URL: https://datasheet.ciiva.com/15189/getdatasheetpartid-326532-15189850.pdf?src-supplier=Verical; ComponentLink1Description: https://datasheet.ciiva.com/15189/getdatasheetpartid-326532-15189850.pdf?src-supplier=Verical; ComponentLink2URL: https://datasheet.ciiva.com/2518/pyu-r-int-thick-7-2518850.pdf?src-supplier=Digi-Key; ComponentLink2Description: https://datasheet.ciiva.com/2518/pyu-r-int-thick-7-2518850.pdf?src-supplier=Digi-Key; ComponentLink3URL: https://datasheet.ciiva.com/2518/pyu-r-int-thick-7-2518851.pdf?src-supplier=Digi-Key; ComponentLink3Description: https://datasheet.ciiva.com/2518/pyu-r-int-thick-7-2518851.pdf?src-supplier=Digi-Key; ComponentLink4URL: https://datasheet.ciiva.com/2518/pyu-r-int-thick-7-2518852.pdf?src-supplier=Digi-Key; ComponentLink4Description: https://datasheet.ciiva.com/2518/pyu-r-int-thick-7-2518852.pdf?src-supplier=Digi-Key; ComponentLink5URL: https://datasheet.ciiva.com/46395/443971-46395070.pdf?src-supplier=Element14; ComponentLink5Description: https://datasheet.ciiva.com/46395/443971-46395070.pdf?src-supplier=Element14; ComponentLink6URL: https://datasheet.ciiva.com/12555/rc0603-272842-12555246.pdf?src-supplier=Mouser; ComponentLink6Description: https://datasheet.ciiva.com/12555/rc0603-272842-12555246.pdf?src-supplier=Mouser; LCSC Part Number: C114681
U6 = MAX3232ESE: 250Kbps transceiver 2/2 SOP-16 RS232 ICs ROHS; Manufacturer: UMW; Item Type: IC; Manufacturer Part Number: MAX3232ESE; Package: SOP-16; LCSC Part Number: C2904738; ComponentLink1Description: LCSC; ComponentLink1URL: https://www.lcsc.com/product-detail/RS232-ICs_UMW-Youtai-Semiconductor-Co-Ltd-MAX3232ESE_C2904738.html
U7 = THVD2450DRBR: IC TRANSCEIVER HALF 1/1 8SON; Manufacturer: Texas Instruments; Supplier: Digikey; Supplier Part Number: 296-THVD2450DRBRCT-ND; Manufacturer Part Number: THVD2450DRBR; RoHS: Yes; Item Type: IC; Stock: 2652; Pricing: 1=4.05, 10=3.639, 25=3.4404, 100=2.9818, 250=2.82892, 500=2.53838, 1000=2.1408 (USD); Pins: 8NUMBER; Length: 3mm; Width: 3mm; Height: 1mm; Thickness: 880um; LCSC Part Number: C2878080

## Nets that join several sheets
+3V3: CAN_Sheet (C21.2 U5.5), Connector_Sheet1 (R57.2 R65.2 R66.2 R68.2), Connector_Sheet2 (6 pins), Controller_Sheet (10 pins), Motor_Driver_Sheet (8 pins), Power_Sheet (C13.2 R76.1 TP3.1 U3.3), RS485_RS232_Sheet (9 pins)
+5V: CAN_Sheet (5 pins), Connector_Sheet1 (6 pins), Connector_Sheet2 (Q9.3 Q11.3 R78.1 R86.1), Power_Sheet (9 pins)
+24V: Motor_Driver_Sheet (12 pins), Power_Sheet (11 pins)
GND: CAN_Sheet (7 pins), Connector_Sheet1 (19 pins), Connector_Sheet2 (18 pins), Controller_Sheet (27 pins), Motor_Driver_Sheet (24 pins), Power_Sheet (19 pins), RS485_RS232_Sheet (12 pins)
ADC_CURRENT1: Controller_Sheet (U1.21), Motor_Driver_Sheet (D12.1 R13.2 U4.4)
ADC_CURRENT2: Controller_Sheet (U1.22), Motor_Driver_Sheet (D13.1 R33.2 U8.4)
ADC_CURRENT3: Controller_Sheet (U1.23), Motor_Driver_Sheet (D16.1 R34.2 U12.4)
ADC_CURRENT4: Controller_Sheet (U1.24), Motor_Driver_Sheet (D17.1 R35.2 U14.4)
CAN_N: CAN_Sheet (R17.2 U5.12), Connector_Sheet1 (J10.1)
CAN_P: CAN_Sheet (R15.1 U5.13), Connector_Sheet1 (J10.2)
CAN_RX: CAN_Sheet (U5.4), Controller_Sheet (U1.15)
CAN_TX: CAN_Sheet (U5.1), Controller_Sheet (U1.16)
DIR1_IN: Connector_Sheet1 (R40.1), Controller_Sheet (U1.61)
DIR2_IN: Connector_Sheet1 (R49.1), Controller_Sheet (U1.58)
DIR3_IN: Connector_Sheet2 (R54.1), Controller_Sheet (U1.55)
DIR4_IN: Connector_Sheet2 (R58.1), Controller_Sheet (U1.52)
EN_CAN: CAN_Sheet (U5.6), Controller_Sheet (U1.29)
FB_1: Connector_Sheet1 (R38.1), Controller_Sheet (U1.63)
FB_2: Connector_Sheet1 (R41.1), Controller_Sheet (U1.60)
FB_3: Connector_Sheet2 (R50.1), Controller_Sheet (U1.57)
FB_4: Connector_Sheet2 (R55.1), Controller_Sheet (U1.54)
INH_MASK: CAN_Sheet (U5.11), Controller_Sheet (U1.32)
M1_PWR: Controller_Sheet (U1.50), Motor_Driver_Sheet (R36.2)
M2_PWR: Controller_Sheet (U1.49), Motor_Driver_Sheet (R46.2)
M3_PWR: Controller_Sheet (U1.48), Motor_Driver_Sheet (R37.2)
M4_PWR: Controller_Sheet (U1.47), Motor_Driver_Sheet (R47.2)
MOTOR1_GND: Connector_Sheet1 (C29.2 J8.4), Motor_Driver_Sheet (R11.2 U4.1)
MOTOR1_PLUS: Connector_Sheet1 (C29.1 J8.5), Motor_Driver_Sheet (R29.4)
MOTOR2_GND: Connector_Sheet1 (C30.2 J9.4), Motor_Driver_Sheet (R31.2 U8.1)
MOTOR2_PLUS: Connector_Sheet1 (C30.1 J9.5), Motor_Driver_Sheet (R43.4)
MOTOR3_GND: Connector_Sheet2 (C31.2 J13.2), Motor_Driver_Sheet (R45.2 U12.1)
MOTOR3_PLUS: Connector_Sheet2 (C31.1 J13.1), Motor_Driver_Sheet (R30.4)
MOTOR4_GND: Connector_Sheet2 (C32.2 J14.2), Motor_Driver_Sheet (R52.2 U14.1)
MOTOR4_PLUS: Connector_Sheet2 (C32.1 J14.1), Motor_Driver_Sheet (R44.4)
nFAULT_CAN: CAN_Sheet (U5.8), Controller_Sheet (U1.27)
nSTB_CAN: CAN_Sheet (U5.14), Controller_Sheet (U1.28)
PWM1_IN: Connector_Sheet1 (R39.1), Controller_Sheet (U1.62)
PWM2_IN: Connector_Sheet1 (R42.1), Controller_Sheet (U1.59)
PWM3_IN: Connector_Sheet2 (R51.1), Controller_Sheet (U1.56)
PWM4_IN: Connector_Sheet2 (R56.1), Controller_Sheet (U1.53)
RE/DE/RS485/T: Controller_Sheet (U1.18), RS485_RS232_Sheet (R19.1 R20.1 U7.2 U7.3)
RS232_RX: Connector_Sheet1 (J12.1), RS485_RS232_Sheet (F3.1)
RS232_TX: Connector_Sheet1 (J12.2), RS485_RS232_Sheet (F4.1)
RS485_N: Connector_Sheet1 (J11.2), RS485_RS232_Sheet (F1.2)
RS485_P: Connector_Sheet1 (J11.1), RS485_RS232_Sheet (F2.2)
RXD/RS232: Controller_Sheet (U1.31), RS485_RS232_Sheet (U6.9)
RXD/RS485: Controller_Sheet (U1.19), RS485_RS232_Sheet (R21.1 U7.4)
TXD/RS232: Controller_Sheet (U1.30), RS485_RS232_Sheet (U6.10)
TXD/RS485: Controller_Sheet (U1.20), RS485_RS232_Sheet (R18.1 U7.1)